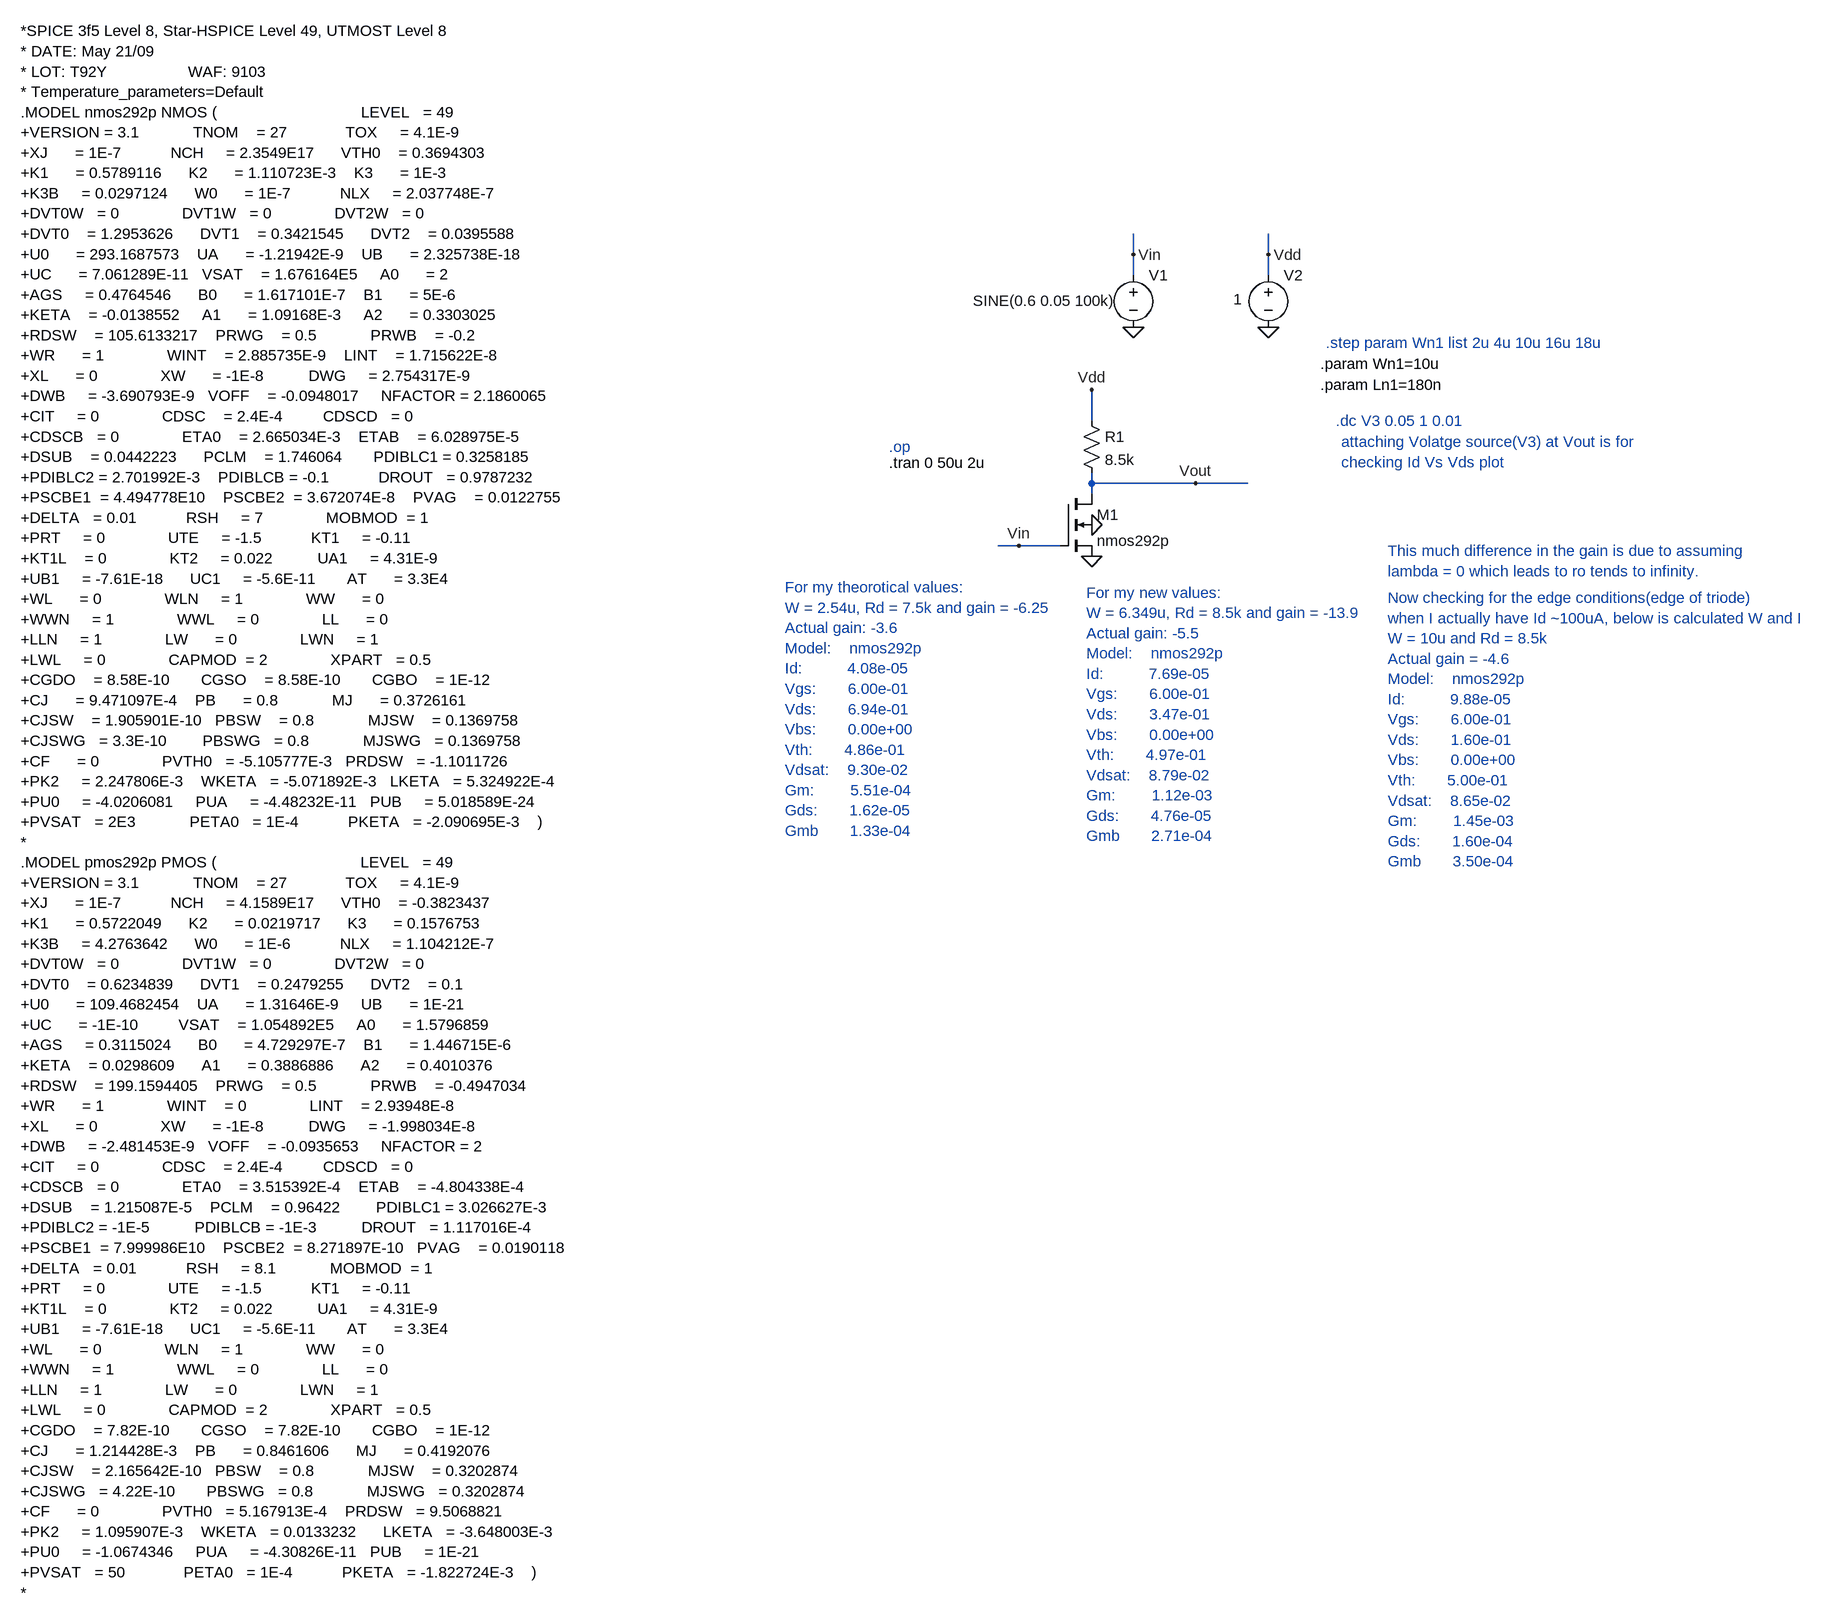
[diagram p0: schematic CS_Rload_100u_final.asc]
CS_Rload_100u_final.asc, the LTspice schematic file:
Version 4
SHEET 1 3004 1492
WIRE 960 128 960 96
WIRE 1168 128 1168 96
WIRE 960 160 960 128
WIRE 1168 160 1168 128
WIRE 896 384 896 336
WIRE 896 480 896 464
WIRE 1056 480 896 480
WIRE 1136 480 1056 480
WIRE 896 496 896 480
WIRE 784 576 752 576
WIRE 848 576 784 576
FLAG 896 592 0
FLAG 896 336 Vdd
FLAG 896 544 0
FLAG 960 240 0
FLAG 1168 240 0
FLAG 1168 128 Vdd
FLAG 960 128 Vin
FLAG 784 576 Vin
FLAG 1056 480 Vout
SYMBOL res 880 368 R0
SYMATTR InstName R1
SYMATTR Value 8.5k
SYMBOL nmos4 848 496 R0
SYMATTR InstName M1
SYMATTR Value nmos292p
SYMATTR Value2 l=Ln1 w=Wn1
SYMBOL voltage 960 144 R0
WINDOW 3 -247 55 Left 2
WINDOW 123 0 0 Left 0
WINDOW 39 0 0 Left 0
SYMATTR Value SINE(0.6 0.05 100k)
SYMATTR InstName V1
SYMBOL voltage 1168 144 R0
WINDOW 3 -54 53 Left 2
WINDOW 123 0 0 Left 0
WINDOW 39 0 0 Left 0
SYMATTR Value 1
SYMATTR InstName V2
TEXT 1248 328 Left 2 !.param Ln1=180n
TEXT 584 448 Left 2 !.tran 0 50u 2u
TEXT 584 424 Left 2 ;.op
TEXT -752 -216 Left 2 !*SPICE 3f5 Level 8, Star-HSPICE Level 49, UTMOST Level 8\n* DATE: May 21/09\n* LOT: T92Y                  WAF: 9103\n* Temperature_parameters=Default\n.MODEL nmos292p NMOS (                                LEVEL   = 49\n+VERSION = 3.1            TNOM    = 27             TOX     = 4.1E-9\n+XJ      = 1E-7           NCH     = 2.3549E17      VTH0    = 0.3694303\n+K1      = 0.5789116      K2      = 1.110723E-3    K3      = 1E-3\n+K3B     = 0.0297124      W0      = 1E-7           NLX     = 2.037748E-7\n+DVT0W   = 0              DVT1W   = 0              DVT2W   = 0\n+DVT0    = 1.2953626      DVT1    = 0.3421545      DVT2    = 0.0395588\n+U0      = 293.1687573    UA      = -1.21942E-9    UB      = 2.325738E-18\n+UC      = 7.061289E-11   VSAT    = 1.676164E5     A0      = 2\n+AGS     = 0.4764546      B0      = 1.617101E-7    B1      = 5E-6\n+KETA    = -0.0138552     A1      = 1.09168E-3     A2      = 0.3303025\n+RDSW    = 105.6133217    PRWG    = 0.5            PRWB    = -0.2\n+WR      = 1              WINT    = 2.885735E-9    LINT    = 1.715622E-8\n+XL      = 0              XW      = -1E-8          DWG     = 2.754317E-9\n+DWB     = -3.690793E-9   VOFF    = -0.0948017     NFACTOR = 2.1860065\n+CIT     = 0              CDSC    = 2.4E-4         CDSCD   = 0\n+CDSCB   = 0              ETA0    = 2.665034E-3    ETAB    = 6.028975E-5\n+DSUB    = 0.0442223      PCLM    = 1.746064       PDIBLC1 = 0.3258185\n+PDIBLC2 = 2.701992E-3    PDIBLCB = -0.1           DROUT   = 0.9787232\n+PSCBE1  = 4.494778E10    PSCBE2  = 3.672074E-8    PVAG    = 0.0122755\n+DELTA   = 0.01           RSH     = 7              MOBMOD  = 1\n+PRT     = 0              UTE     = -1.5           KT1     = -0.11\n+KT1L    = 0              KT2     = 0.022          UA1     = 4.31E-9\n+UB1     = -7.61E-18      UC1     = -5.6E-11       AT      = 3.3E4\n+WL      = 0              WLN     = 1              WW      = 0\n+WWN     = 1              WWL     = 0              LL      = 0\n+LLN     = 1              LW      = 0              LWN     = 1\n+LWL     = 0              CAPMOD  = 2              XPART   = 0.5\n+CGDO    = 8.58E-10       CGSO    = 8.58E-10       CGBO    = 1E-12\n+CJ      = 9.471097E-4    PB      = 0.8            MJ      = 0.3726161\n+CJSW    = 1.905901E-10   PBSW    = 0.8            MJSW    = 0.1369758\n+CJSWG   = 3.3E-10        PBSWG   = 0.8            MJSWG   = 0.1369758\n+CF      = 0              PVTH0   = -5.105777E-3   PRDSW   = -1.1011726\n+PK2     = 2.247806E-3    WKETA   = -5.071892E-3   LKETA   = 5.324922E-4\n+PU0     = -4.0206081     PUA     = -4.48232E-11   PUB     = 5.018589E-24\n+PVSAT   = 2E3            PETA0   = 1E-4           PKETA   = -2.090695E-3    )\n*\n.MODEL pmos292p PMOS (                                LEVEL   = 49\n+VERSION = 3.1            TNOM    = 27             TOX     = 4.1E-9\n+XJ      = 1E-7           NCH     = 4.1589E17      VTH0    = -0.3823437\n+K1      = 0.5722049      K2      = 0.0219717      K3      = 0.1576753\n+K3B     = 4.2763642      W0      = 1E-6           NLX     = 1.104212E-7\n+DVT0W   = 0              DVT1W   = 0              DVT2W   = 0\n+DVT0    = 0.6234839      DVT1    = 0.2479255      DVT2    = 0.1\n+U0      = 109.4682454    UA      = 1.31646E-9     UB      = 1E-21\n+UC      = -1E-10         VSAT    = 1.054892E5     A0      = 1.5796859\n+AGS     = 0.3115024      B0      = 4.729297E-7    B1      = 1.446715E-6\n+KETA    = 0.0298609      A1      = 0.3886886      A2      = 0.4010376\n+RDSW    = 199.1594405    PRWG    = 0.5            PRWB    = -0.4947034\n+WR      = 1              WINT    = 0              LINT    = 2.93948E-8\n+XL      = 0              XW      = -1E-8          DWG     = -1.998034E-8\n+DWB     = -2.481453E-9   VOFF    = -0.0935653     NFACTOR = 2\n+CIT     = 0              CDSC    = 2.4E-4         CDSCD   = 0\n+CDSCB   = 0              ETA0    = 3.515392E-4    ETAB    = -4.804338E-4\n+DSUB    = 1.215087E-5    PCLM    = 0.96422        PDIBLC1 = 3.026627E-3\n+PDIBLC2 = -1E-5          PDIBLCB = -1E-3          DROUT   = 1.117016E-4\n+PSCBE1  = 7.999986E10    PSCBE2  = 8.271897E-10   PVAG    = 0.0190118\n+DELTA   = 0.01           RSH     = 8.1            MOBMOD  = 1\n+PRT     = 0              UTE     = -1.5           KT1     = -0.11\n+KT1L    = 0              KT2     = 0.022          UA1     = 4.31E-9\n+UB1     = -7.61E-18      UC1     = -5.6E-11       AT      = 3.3E4\n+WL      = 0              WLN     = 1              WW      = 0\n+WWN     = 1              WWL     = 0              LL      = 0\n+LLN     = 1              LW      = 0              LWN     = 1\n+LWL     = 0              CAPMOD  = 2              XPART   = 0.5\n+CGDO    = 7.82E-10       CGSO    = 7.82E-10       CGBO    = 1E-12\n+CJ      = 1.214428E-3    PB      = 0.8461606      MJ      = 0.4192076\n+CJSW    = 2.165642E-10   PBSW    = 0.8            MJSW    = 0.3202874\n+CJSWG   = 4.22E-10       PBSWG   = 0.8            MJSWG   = 0.3202874\n+CF      = 0              PVTH0   = 5.167913E-4    PRDSW   = 9.5068821\n+PK2     = 1.095907E-3    WKETA   = 0.0133232      LKETA   = -3.648003E-3\n+PU0     = -1.0674346     PUA     = -4.30826E-11   PUB     = 1E-21\n+PVSAT   = 50             PETA0   = 1E-4           PKETA   = -1.822724E-3    )\n*
TEXT 1248 296 Left 2 !.param Wn1=10u
TEXT 424 640 Left 2 ;For my theorotical values:\nW = 2.54u, Rd = 7.5k and gain = -6.25\nActual gain: -3.6\nModel:    nmos292p\nId:          4.08e-05\nVgs:       6.00e-01\nVds:       6.94e-01\nVbs:       0.00e+00\nVth:       4.86e-01\nVdsat:    9.30e-02\nGm:        5.51e-04\nGds:       1.62e-05\nGmb       1.33e-04
TEXT 888 648 Left 2 ;For my new values:\nW = 6.349u, Rd = 8.5k and gain = -13.9\nActual gain: -5.5\nModel:    nmos292p\nId:          7.69e-05\nVgs:       6.00e-01\nVds:       3.47e-01\nVbs:       0.00e+00\nVth:       4.97e-01\nVdsat:    8.79e-02\nGm:        1.12e-03\nGds:       4.76e-05\nGmb       2.71e-04
TEXT 1352 584 Left 2 ;This much difference in the gain is due to assuming \nlambda = 0 which leads to ro tends to infinity.
TEXT 1352 656 Left 2 ;Now checking for the edge conditions(edge of triode) \nwhen I actually have Id ~100uA, below is calculated W and I\nW = 10u and Rd = 8.5k \nActual gain = -4.6\nModel:    nmos292p\nId:          9.88e-05\nVgs:       6.00e-01\nVds:       1.60e-01\nVbs:       0.00e+00\nVth:       5.00e-01\nVdsat:    8.65e-02\nGm:        1.45e-03\nGds:       1.60e-04\nGmb       3.50e-04
TEXT 1256 264 Left 2 ;.step param Wn1 list 2u 4u 10u 16u 18u
TEXT 1272 384 Left 2 ;.dc V3 0.05 1 0.01
TEXT 1280 416 Left 2 ;attaching Volatge source(V3) at Vout is for \nchecking Id Vs Vds plot

The netlist it stands for:
* CS_Rload_100u_final.asc
R1 Vdd Vout 8.5k
M1 Vout Vin 0 0 nmos292p l=Ln1 w=Wn1
V1 Vin 0 SINE(0.6 0.05 100k)
V2 Vdd 0 1
.model NMOS NMOS
.model PMOS PMOS
.lib standard.mos
.param Ln1=180n
.tran 0 50u 2u
* .op
*SPICE 3f5 Level 8, Star-HSPICE Level 49, UTMOST Level 8
* DATE: May 21/09
* LOT: T92Y                  WAF: 9103
* Temperature_parameters=Default
.MODEL nmos292p NMOS (                                LEVEL   = 49
+VERSION = 3.1            TNOM    = 27             TOX     = 4.1E-9
+XJ      = 1E-7           NCH     = 2.3549E17      VTH0    = 0.3694303
+K1      = 0.5789116      K2      = 1.110723E-3    K3      = 1E-3
+K3B     = 0.0297124      W0      = 1E-7           NLX     = 2.037748E-7
+DVT0W   = 0              DVT1W   = 0              DVT2W   = 0
+DVT0    = 1.2953626      DVT1    = 0.3421545      DVT2    = 0.0395588
+U0      = 293.1687573    UA      = -1.21942E-9    UB      = 2.325738E-18
+UC      = 7.061289E-11   VSAT    = 1.676164E5     A0      = 2
+AGS     = 0.4764546      B0      = 1.617101E-7    B1      = 5E-6
+KETA    = -0.0138552     A1      = 1.09168E-3     A2      = 0.3303025
+RDSW    = 105.6133217    PRWG    = 0.5            PRWB    = -0.2
+WR      = 1              WINT    = 2.885735E-9    LINT    = 1.715622E-8
+XL      = 0              XW      = -1E-8          DWG     = 2.754317E-9
+DWB     = -3.690793E-9   VOFF    = -0.0948017     NFACTOR = 2.1860065
+CIT     = 0              CDSC    = 2.4E-4         CDSCD   = 0
+CDSCB   = 0              ETA0    = 2.665034E-3    ETAB    = 6.028975E-5
+DSUB    = 0.0442223      PCLM    = 1.746064       PDIBLC1 = 0.3258185
+PDIBLC2 = 2.701992E-3    PDIBLCB = -0.1           DROUT   = 0.9787232
+PSCBE1  = 4.494778E10    PSCBE2  = 3.672074E-8    PVAG    = 0.0122755
+DELTA   = 0.01           RSH     = 7              MOBMOD  = 1
+PRT     = 0              UTE     = -1.5           KT1     = -0.11
+KT1L    = 0              KT2     = 0.022          UA1     = 4.31E-9
+UB1     = -7.61E-18      UC1     = -5.6E-11       AT      = 3.3E4
+WL      = 0              WLN     = 1              WW      = 0
+WWN     = 1              WWL     = 0              LL      = 0
+LLN     = 1              LW      = 0              LWN     = 1
+LWL     = 0              CAPMOD  = 2              XPART   = 0.5
+CGDO    = 8.58E-10       CGSO    = 8.58E-10       CGBO    = 1E-12
+CJ      = 9.471097E-4    PB      = 0.8            MJ      = 0.3726161
+CJSW    = 1.905901E-10   PBSW    = 0.8            MJSW    = 0.1369758
+CJSWG   = 3.3E-10        PBSWG   = 0.8            MJSWG   = 0.1369758
+CF      = 0              PVTH0   = -5.105777E-3   PRDSW   = -1.1011726
+PK2     = 2.247806E-3    WKETA   = -5.071892E-3   LKETA   = 5.324922E-4
+PU0     = -4.0206081     PUA     = -4.48232E-11   PUB     = 5.018589E-24
+PVSAT   = 2E3            PETA0   = 1E-4           PKETA   = -2.090695E-3    )
*
.MODEL pmos292p PMOS (                                LEVEL   = 49
+VERSION = 3.1            TNOM    = 27             TOX     = 4.1E-9
+XJ      = 1E-7           NCH     = 4.1589E17      VTH0    = -0.3823437
+K1      = 0.5722049      K2      = 0.0219717      K3      = 0.1576753
+K3B     = 4.2763642      W0      = 1E-6           NLX     = 1.104212E-7
+DVT0W   = 0              DVT1W   = 0              DVT2W   = 0
+DVT0    = 0.6234839      DVT1    = 0.2479255      DVT2    = 0.1
+U0      = 109.4682454    UA      = 1.31646E-9     UB      = 1E-21
+UC      = -1E-10         VSAT    = 1.054892E5     A0      = 1.5796859
+AGS     = 0.3115024      B0      = 4.729297E-7    B1      = 1.446715E-6
+KETA    = 0.0298609      A1      = 0.3886886      A2      = 0.4010376
+RDSW    = 199.1594405    PRWG    = 0.5            PRWB    = -0.4947034
+WR      = 1              WINT    = 0              LINT    = 2.93948E-8
+XL      = 0              XW      = -1E-8          DWG     = -1.998034E-8
+DWB     = -2.481453E-9   VOFF    = -0.0935653     NFACTOR = 2
+CIT     = 0              CDSC    = 2.4E-4         CDSCD   = 0
+CDSCB   = 0              ETA0    = 3.515392E-4    ETAB    = -4.804338E-4
+DSUB    = 1.215087E-5    PCLM    = 0.96422        PDIBLC1 = 3.026627E-3
+PDIBLC2 = -1E-5          PDIBLCB = -1E-3          DROUT   = 1.117016E-4
+PSCBE1  = 7.999986E10    PSCBE2  = 8.271897E-10   PVAG    = 0.0190118
+DELTA   = 0.01           RSH     = 8.1            MOBMOD  = 1
+PRT     = 0              UTE     = -1.5           KT1     = -0.11
+KT1L    = 0              KT2     = 0.022          UA1     = 4.31E-9
+UB1     = -7.61E-18      UC1     = -5.6E-11       AT      = 3.3E4
+WL      = 0              WLN     = 1              WW      = 0
+WWN     = 1              WWL     = 0              LL      = 0
+LLN     = 1              LW      = 0              LWN     = 1
+LWL     = 0              CAPMOD  = 2              XPART   = 0.5
+CGDO    = 7.82E-10       CGSO    = 7.82E-10       CGBO    = 1E-12
+CJ      = 1.214428E-3    PB      = 0.8461606      MJ      = 0.4192076
+CJSW    = 2.165642E-10   PBSW    = 0.8            MJSW    = 0.3202874
+CJSWG   = 4.22E-10       PBSWG   = 0.8            MJSWG   = 0.3202874
+CF      = 0              PVTH0   = 5.167913E-4    PRDSW   = 9.5068821
+PK2     = 1.095907E-3    WKETA   = 0.0133232      LKETA   = -3.648003E-3
+PU0     = -1.0674346     PUA     = -4.30826E-11   PUB     = 1E-21
+PVSAT   = 50             PETA0   = 1E-4           PKETA   = -1.822724E-3    )
*
.param Wn1=10u
* For my theorotical values:
* W = 2.54u, Rd = 7.5k and gain = -6.25
* Actual gain: -3.6
* Model:    nmos292p
* Id:          4.08e-05
* Vgs:       6.00e-01
* Vds:       6.94e-01
* Vbs:       0.00e+00
* Vth:       4.86e-01
* Vdsat:    9.30e-02
* Gm:        5.51e-04
* Gds:       1.62e-05
* Gmb       1.33e-04
* For my new values:
* W = 6.349u, Rd = 8.5k and gain = -13.9
* Actual gain: -5.5
* Model:    nmos292p
* Id:          7.69e-05
* Vgs:       6.00e-01
* Vds:       3.47e-01
* Vbs:       0.00e+00
* Vth:       4.97e-01
* Vdsat:    8.79e-02
* Gm:        1.12e-03
* Gds:       4.76e-05
* Gmb       2.71e-04
* This much difference in the gain is due to assuming
* lambda = 0 which leads to ro tends to infinity.
* Now checking for the edge conditions(edge of triode)
* when I actually have Id ~100uA, below is calculated W and I
* W = 10u and Rd = 8.5k
* Actual gain = -4.6
* Model:    nmos292p
* Id:          9.88e-05
* Vgs:       6.00e-01
* Vds:       1.60e-01
* Vbs:       0.00e+00
* Vth:       5.00e-01
* Vdsat:    8.65e-02
* Gm:        1.45e-03
* Gds:       1.60e-04
* Gmb       3.50e-04
* .step param Wn1 list 2u 4u 10u 16u 18u
* .dc V3 0.05 1 0.01
* attaching Volatge source(V3) at Vout is for
* checking Id Vs Vds plot
.backanno
.end